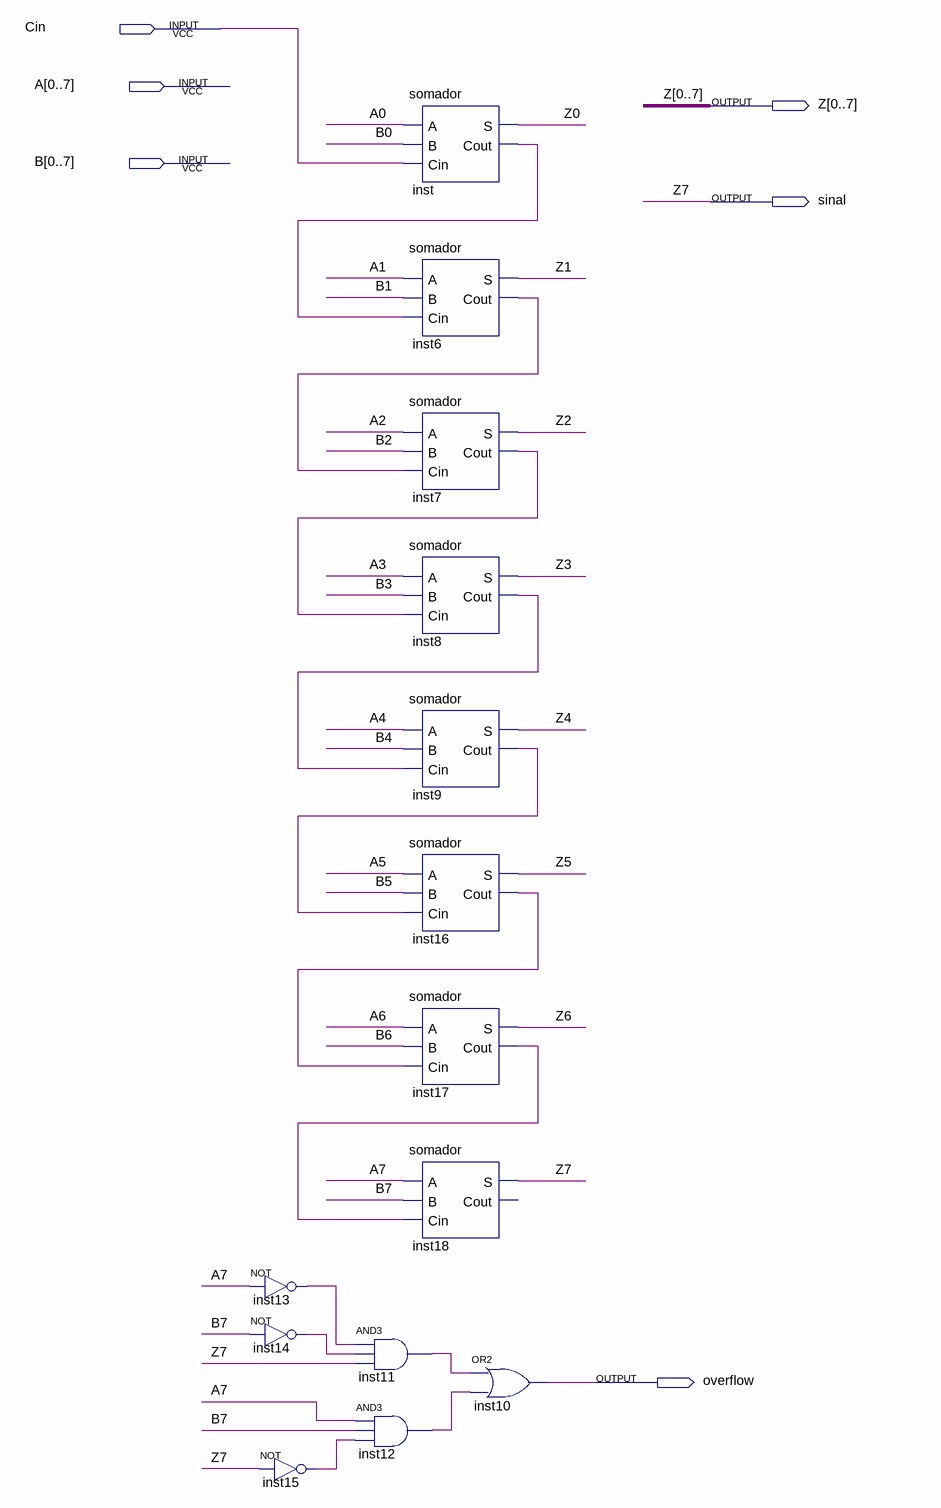
[diagram p0: schematic sheet]
// Quartus schematic somador8bits.bdf as structural Verilog: 14 symbols, 6 pins
module somador8bits (
  input  Cin,
  input  [0:7] A,
  input  [0:7] B,
  output [0:7] Z,
  output sinal,
  output overflow
);

  wire inst6_cout, inst7_cout, inst8_cout, inst9_cout, inst11_out, inst12_out, inst13_out, inst14_out,
       inst15_out, inst16_cout, inst17_cout, inst_cout;

  not inst13 (inst13_out, A[7]);
  not inst14 (inst14_out, B[7]);
  not inst15 (inst15_out, sinal);
  somador inst (.A(A[0]), .B(B[0]), .Cin(Cin), .S(Z[0]), .Cout(inst_cout));
  somador inst6 (.A(A[1]), .B(B[1]), .Cin(inst_cout), .S(Z[1]), .Cout(inst6_cout));
  somador inst7 (.A(A[2]), .B(B[2]), .Cin(inst6_cout), .S(Z[2]), .Cout(inst7_cout));
  somador inst8 (.A(A[3]), .B(B[3]), .Cin(inst7_cout), .S(Z[3]), .Cout(inst8_cout));
  somador inst9 (.A(A[4]), .B(B[4]), .Cin(inst8_cout), .S(Z[4]), .Cout(inst9_cout));
  somador inst16 (.A(A[5]), .B(B[5]), .Cin(inst9_cout), .S(Z[5]), .Cout(inst16_cout));
  somador inst17 (.A(A[6]), .B(B[6]), .Cin(inst16_cout), .S(Z[6]), .Cout(inst17_cout));
  somador inst18 (.A(A[7]), .B(B[7]), .Cin(inst17_cout), .S(sinal));  // open: Cout
  and inst11 (inst11_out, inst13_out, inst14_out, sinal);
  and inst12 (inst12_out, A[7], B[7], inst15_out);
  or inst10 (overflow, inst11_out, inst12_out);

  assign Z[7] = sinal;

  // Other names for the same wires on the sheet: Z7 = sinal
endmodule
